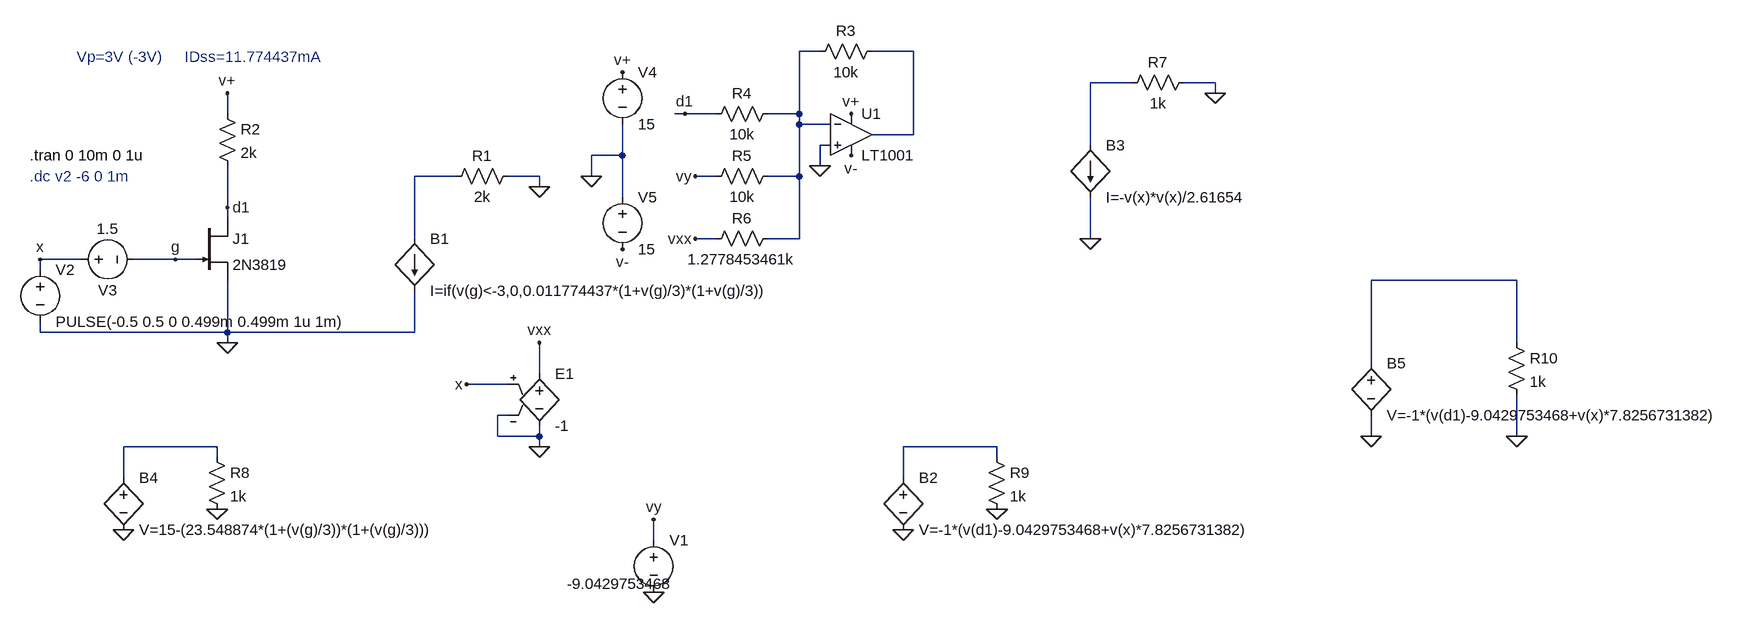
[diagram p0: schematic jfet_transf2.asc]
jfet_transf2.asc, the LTspice schematic file:
Version 4
SHEET 1 2624 740
WIRE 1152 -112 1120 -112
WIRE 1296 -112 1232 -112
WIRE 1632 -64 1568 -64
WIRE 1760 -64 1712 -64
WIRE 1760 -48 1760 -64
WIRE 240 -16 240 -48
WIRE 944 -16 928 -16
WIRE 992 -16 944 -16
WIRE 1120 -16 1120 -112
WIRE 1120 -16 1072 -16
WIRE 1120 0 1120 -16
WIRE 1168 0 1120 0
WIRE 1296 16 1296 -112
WIRE 1296 16 1232 16
WIRE 1168 32 1152 32
WIRE 1568 32 1568 -64
WIRE 848 48 848 0
WIRE 848 48 800 48
WIRE 1152 64 1152 32
WIRE 592 80 528 80
WIRE 720 80 672 80
WIRE 800 80 800 48
WIRE 992 80 960 80
WIRE 1120 80 1120 0
WIRE 1120 80 1072 80
WIRE 720 96 720 80
WIRE 848 112 848 48
WIRE 240 128 240 64
WIRE 240 144 240 128
WIRE 528 176 528 80
WIRE 992 176 960 176
WIRE 1120 176 1120 80
WIRE 1120 176 1072 176
WIRE 1568 176 1568 112
WIRE 16 208 -48 208
WIRE 160 208 96 208
WIRE 192 208 160 208
WIRE -48 224 -48 208
WIRE 2224 240 2000 240
WIRE -48 320 -48 304
WIRE 240 320 240 240
WIRE 240 320 -48 320
WIRE 528 320 528 256
WIRE 528 320 240 320
WIRE 240 336 240 320
WIRE 2224 336 2224 240
WIRE 2000 368 2000 240
WIRE 720 384 720 336
WIRE 672 400 608 400
WIRE 672 448 656 448
WIRE 656 480 656 448
WIRE 720 480 720 464
WIRE 720 480 656 480
WIRE 2000 480 2000 448
WIRE 2224 480 2224 416
WIRE 224 496 80 496
WIRE 720 496 720 480
WIRE 1424 496 1280 496
WIRE 224 512 224 496
WIRE 1424 512 1424 496
WIRE 80 544 80 496
WIRE 1280 544 1280 496
WIRE 896 640 896 608
FLAG 240 336 0
FLAG 160 208 g
FLAG 720 96 0
FLAG 800 80 0
FLAG 848 -80 v+
FLAG 848 192 v-
FLAG 240 -48 v+
FLAG 1200 -16 v+
FLAG 1200 48 v-
FLAG -48 208 x
FLAG 960 176 vxx
FLAG 896 720 0
FLAG 896 608 vy
FLAG 960 80 vy
FLAG 240 128 d1
FLAG 1152 64 0
FLAG 1760 -48 0
FLAG 1568 176 0
FLAG 1280 624 0
FLAG 1424 592 0
FLAG 80 624 0
FLAG 224 592 0
FLAG 944 -16 d1
FLAG 720 496 0
FLAG 608 400 x
FLAG 720 336 vxx
FLAG 2000 480 0
FLAG 2224 480 0
SYMBOL njf 192 144 R0
SYMATTR InstName J1
SYMATTR Value 2N3819
SYMBOL voltage -48 208 R0
WINDOW 123 0 0 Left 0
WINDOW 39 0 0 Left 0
SYMATTR InstName V2
SYMATTR Value PULSE(-0.5 0.5 0 0.499m 0.499m 1u 1m)
SYMBOL bi 528 176 R0
SYMATTR InstName B1
SYMATTR Value I=if(v(g)<-3,0,0.011774437*(1+v(g)/3)*(1+v(g)/3))
SYMBOL res 688 64 R90
WINDOW 0 0 56 VBottom 2
WINDOW 3 32 56 VTop 2
SYMATTR InstName R1
SYMATTR Value 2k
SYMBOL res 224 -32 R0
SYMATTR InstName R2
SYMATTR Value 2k
SYMBOL voltage 0 208 R270
WINDOW 0 -32 56 VBottom 2
WINDOW 3 32 56 VTop 2
WINDOW 123 0 0 Left 0
WINDOW 39 0 0 Left 0
SYMATTR InstName V3
SYMATTR Value 1.5
SYMBOL voltage 848 -96 R0
WINDOW 123 0 0 Left 0
WINDOW 39 0 0 Left 0
SYMATTR InstName V4
SYMATTR Value 15
SYMBOL voltage 848 96 R0
WINDOW 123 0 0 Left 0
WINDOW 39 0 0 Left 0
SYMATTR InstName V5
SYMATTR Value 15
SYMBOL OpAmps\\LT1001 1200 -48 R0
SYMATTR InstName U1
SYMBOL res 1248 -128 R90
WINDOW 0 0 56 VBottom 2
WINDOW 3 32 56 VTop 2
SYMATTR InstName R3
SYMATTR Value 10k
SYMBOL res 1088 -32 R90
WINDOW 0 0 56 VBottom 2
WINDOW 3 32 56 VTop 2
SYMATTR InstName R4
SYMATTR Value 10k
SYMBOL res 1088 64 R90
WINDOW 0 0 56 VBottom 2
WINDOW 3 32 56 VTop 2
SYMATTR InstName R5
SYMATTR Value 10k
SYMBOL res 1088 160 R90
WINDOW 0 0 56 VBottom 2
WINDOW 3 32 56 VTop 2
SYMATTR InstName R6
SYMATTR Value 1.2778453461k
SYMBOL voltage 896 624 R0
WINDOW 3 -133 83 Left 2
WINDOW 123 0 0 Left 0
WINDOW 39 0 0 Left 0
SYMATTR Value -9.0429753468
SYMATTR InstName V1
SYMBOL bi 1568 32 R0
SYMATTR InstName B3
SYMATTR Value I=-v(x)*v(x)/2.61654
SYMBOL res 1728 -80 R90
WINDOW 0 0 56 VBottom 2
WINDOW 3 32 56 VTop 2
SYMATTR InstName R7
SYMATTR Value 1k
SYMBOL bv 1280 528 R0
SYMATTR InstName B2
SYMATTR Value V=-1*(v(d1)-9.0429753468+v(x)*7.8256731382)
SYMBOL res 1408 496 R0
SYMATTR InstName R9
SYMATTR Value 1k
SYMBOL bv 80 528 R0
SYMATTR InstName B4
SYMATTR Value V=15-(23.548874*(1+(v(g)/3))*(1+(v(g)/3)))
SYMBOL res 208 496 R0
SYMATTR InstName R8
SYMATTR Value 1k
SYMBOL e 720 368 R0
SYMATTR InstName E1
SYMATTR Value -1
SYMBOL bv 2000 352 R0
SYMATTR InstName B5
SYMATTR Value V=-1*(v(d1)-9.0429753468+v(x)*7.8256731382)
SYMBOL res 2208 320 R0
SYMATTR InstName R10
SYMATTR Value 1k
TEXT -64 80 Left 2 ;.dc v2 -6 0 1m
TEXT -64 48 Left 2 !.tran 0 10m 0 1u
TEXT 8 -104 Left 2 ;Vp=3V (-3V)     IDss=11.774437mA

The netlist it stands for:
* jfet_transf2.asc
J1 d1 g 0 2N3819
V2 x 0 PULSE(-0.5 0.5 0 0.499m 0.499m 1u 1m)
B1 N004 0 I=if(v(g)<-3,0,0.011774437*(1+v(g)/3)*(1+v(g)/3))
R1 0 N004 2k
R2 v+ d1 2k
V3 x g 1.5
V4 v+ 0 15
V5 0 v- 15
XU1 0 N001 v+ v- N002 LT1001  ; pins In+ In- V+ V- OUT
R3 N002 N001 10k
R4 N001 d1 10k
R5 N001 vy 10k
R6 N001 vxx 1.2778453461k
V1 vy 0 -9.0429753468
B3 N003 0 I=-v(x)*v(x)/2.61654
R7 0 N003 1k
B2 N007 0 V=-1*(v(d1)-9.0429753468+v(x)*7.8256731382)
R9 N007 0 1k
B4 N006 0 V=15-(23.548874*(1+(v(g)/3))*(1+(v(g)/3)))
R8 N006 0 1k
E1 vxx 0 x 0 -1
B5 N005 0 V=-1*(v(d1)-9.0429753468+v(x)*7.8256731382)
R10 N005 0 1k
.model NJF NJF
.model PJF PJF
.lib standard.jft
* .dc v2 -6 0 1m
.tran 0 10m 0 1u
* Vp=3V (-3V)     IDss=11.774437mA
.lib LTC.lib
.backanno
.end